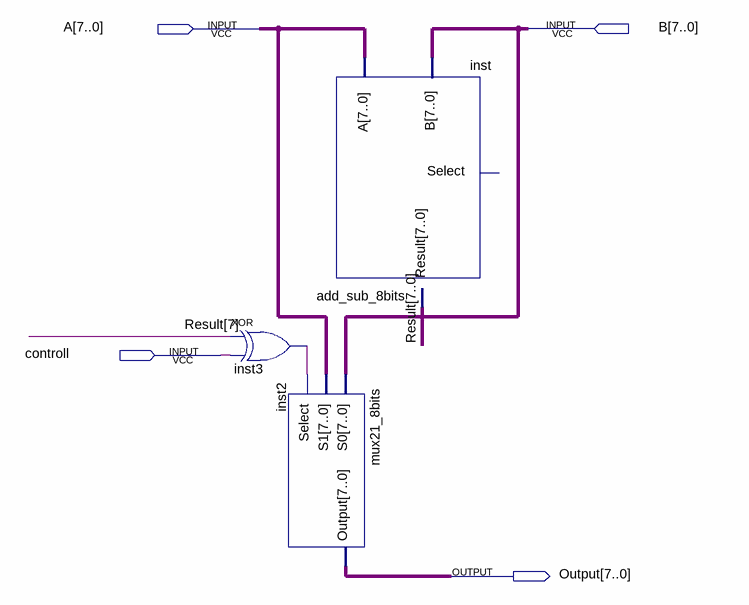
[diagram p0: schematic sheet]
// Quartus schematic min_max.bdf as structural Verilog: 3 symbols, 4 pins
module min_max (
  input  [7:0] A,
  input  [7:0] B,
  input  controll,
  output [7:0] Output
);

  wire inst3_out;
  wire [7:0] Result;

  xor inst3 (inst3_out, Result[7], controll);
  add_sub_8bits inst (.A(A), .B(B), .Result(Result));  // open: Select
  mux21_8bits inst2 (.S0(B), .S1(A), .Select(inst3_out), .Output(Output));
endmodule
